# Altium schematic sheet Dcdc.12V0.+16V5.SchDoc
size A4
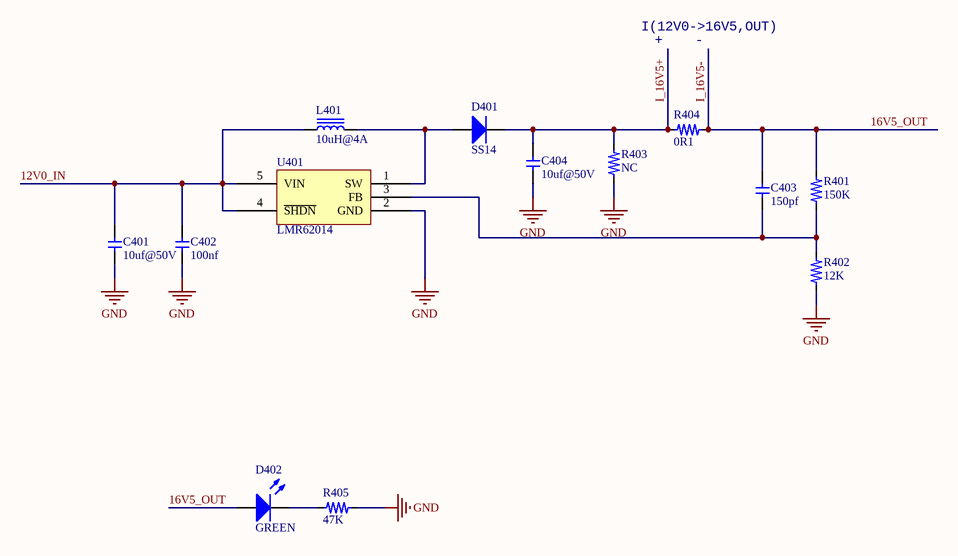
[diagram p0: Dcdc.12V0.+16V5.SchDoc]

## Parts
C401  value 10uf@50V  [C1210]  (hidden comment: Cap)
C402  value 100nf  [C0603]  (hidden comment: Cap)
C403  value 150pf  [C0603]  (hidden comment: Cap)
C404  value 10uf@50V  [C1210]  (hidden comment: Cap)
D401  value SS14  [DIODE-SMAF]  (hidden comment: Diode)
D402  value GREEN  [LED0603]  (hidden comment: LED)
L401  value 10uH@4A  [L06063]  (hidden comment: Inductor Iron)
R401  value 150K  [R0603]  (hidden comment: Res)
R402  value 12K  [R0603]  (hidden comment: Res)
R403  value NC  [R1210]  (hidden comment: Res)
R404  value 0R1  [R1206]  (hidden comment: Res)
R405  value 47K  [R0603]  (hidden comment: Res)
U401  LMR62014  [LMR62014-SOT23-5]

## Nets
GND: C401.1 C402.1 C404.1 R402.1 R403.1 R405.1 U401.2(GND)
12V0_IN: C401.2 C402.2 L401.1 U401.4(~{SHDN}) U401.5(VIN)
16V5_OUT: C403.1 D402.1(A) R401.2 R404.2  [also labelled I_16V5-]
I_16V5+: C404.2 D401.2(K) R403.2 R404.1
NetC403_2: C403.2 R401.1 R402.2 U401.3(FB)
NetD401_1: D401.1(A) L401.2 U401.1(SW)
NetD402_2: D402.2(K) R405.2

## Notes on the sheet
- I(12V0->16V5,OUT)
- +
- -

## Library data of the parts
D401 = Diode: 通用二极管
L401 = Inductor Iron: Magnetic-Core Inductor
R401-R405 = Res: 电阻
U401 = LMR62014: LMR62014 SIMPLE SWITCHER® 20Vout, 1.4A Step-Up Voltage Regulator in SOT-23